# Altium project Syncbox.PrjPcb (part 3 of 3)

## Sheet [08] - CPU USB.SchDoc
size A2; Organization: Altium Limited; Address1: L3, 12a Rodborough Rd; Address2: Frenchs Forest; Address3: NSW; Address4: Australia 2086; DocumentNumber: 8; SheetNumber: 8; SheetTotal: 11
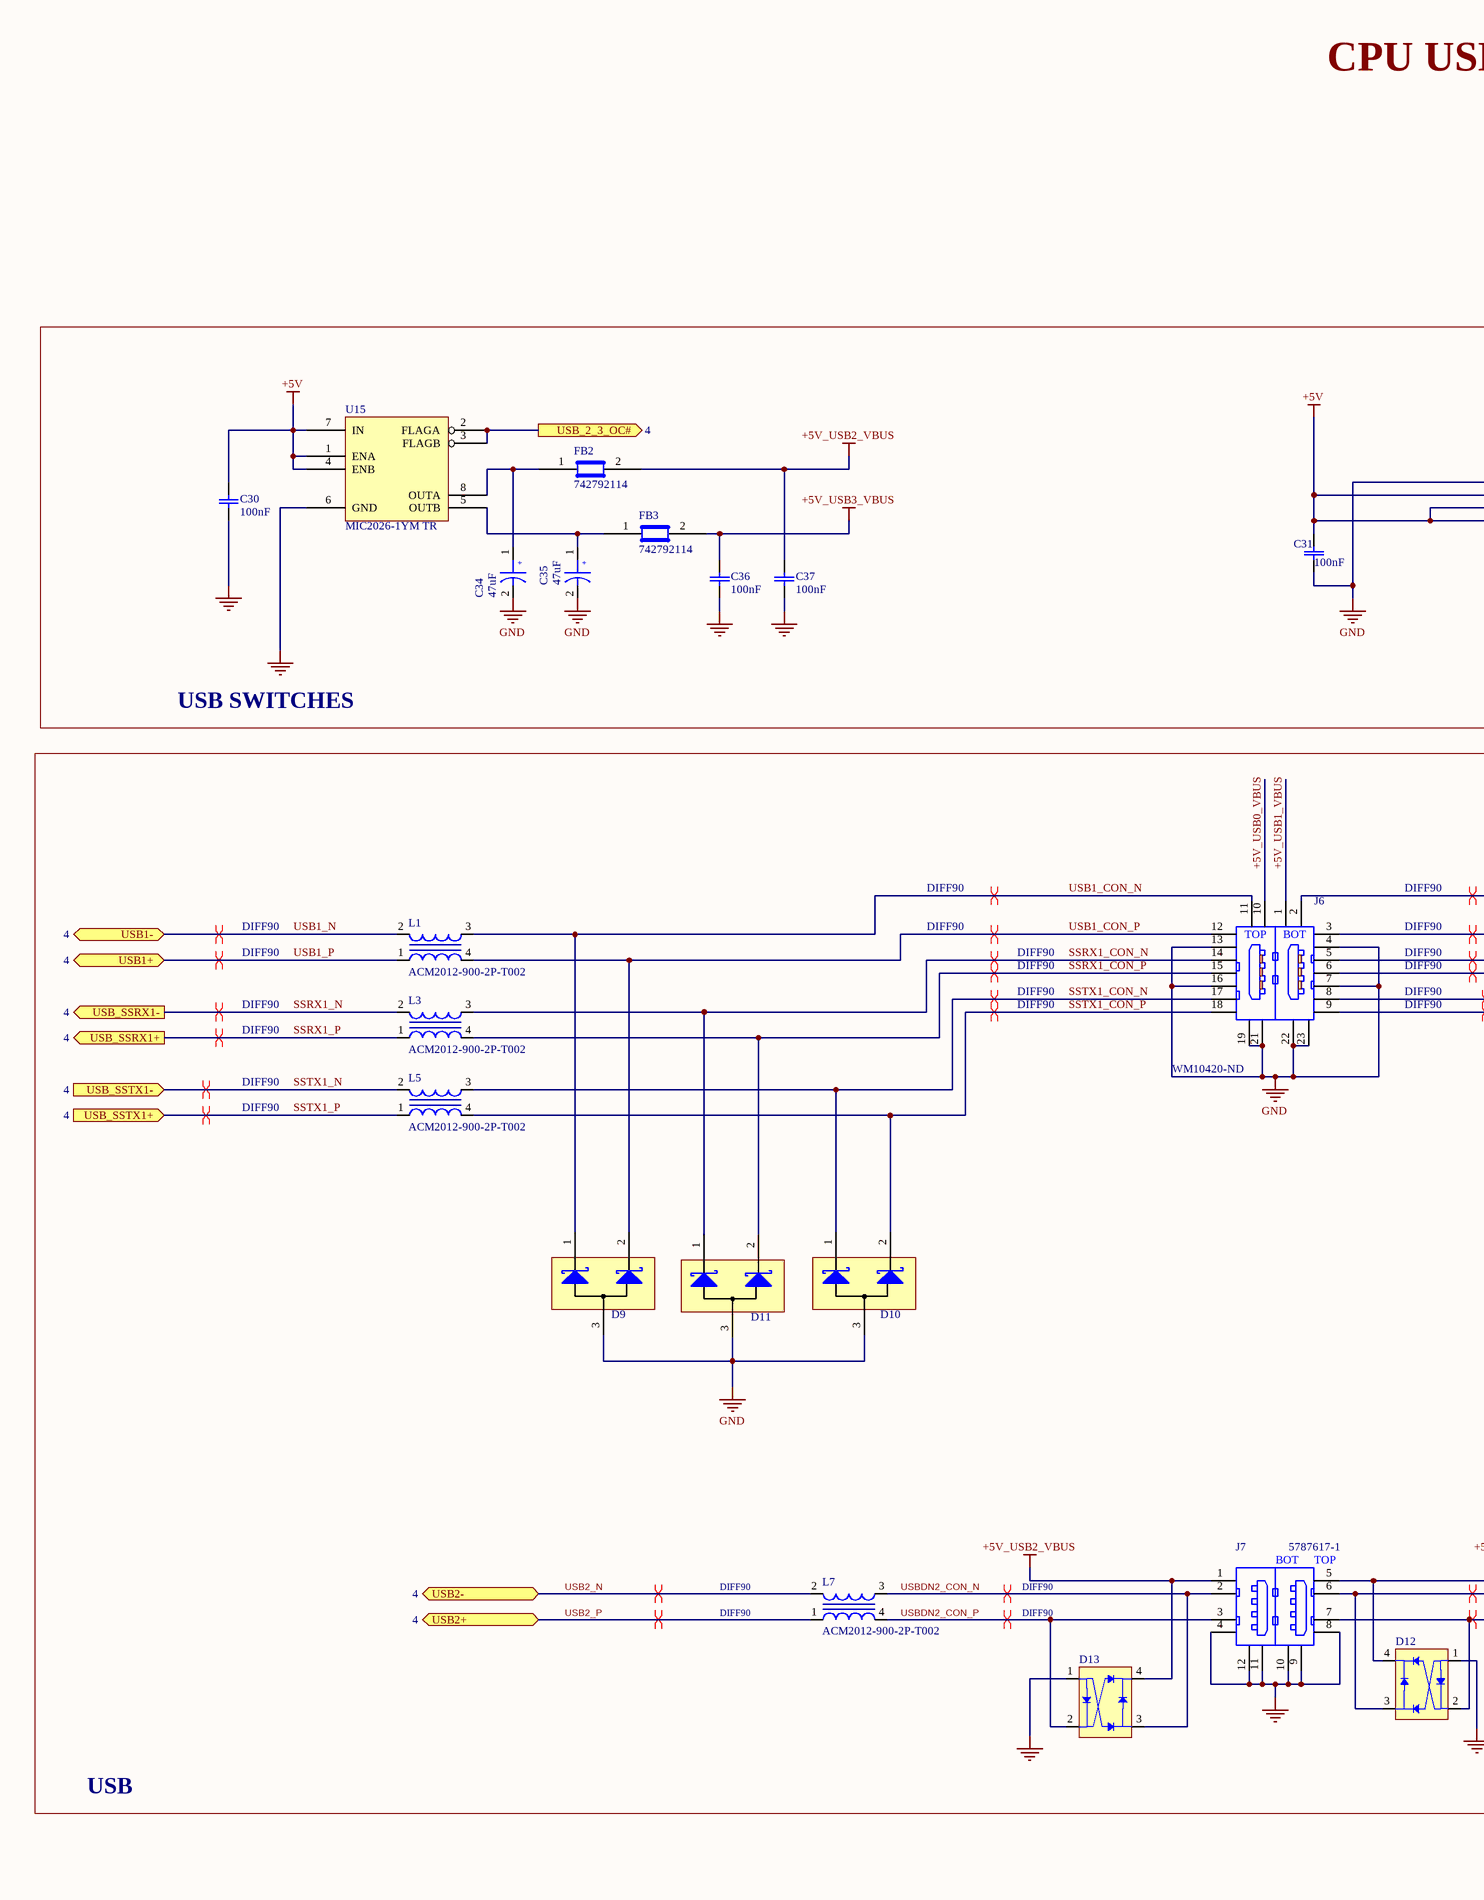
[diagram p3: [08] - CPU USB.SchDoc, left]
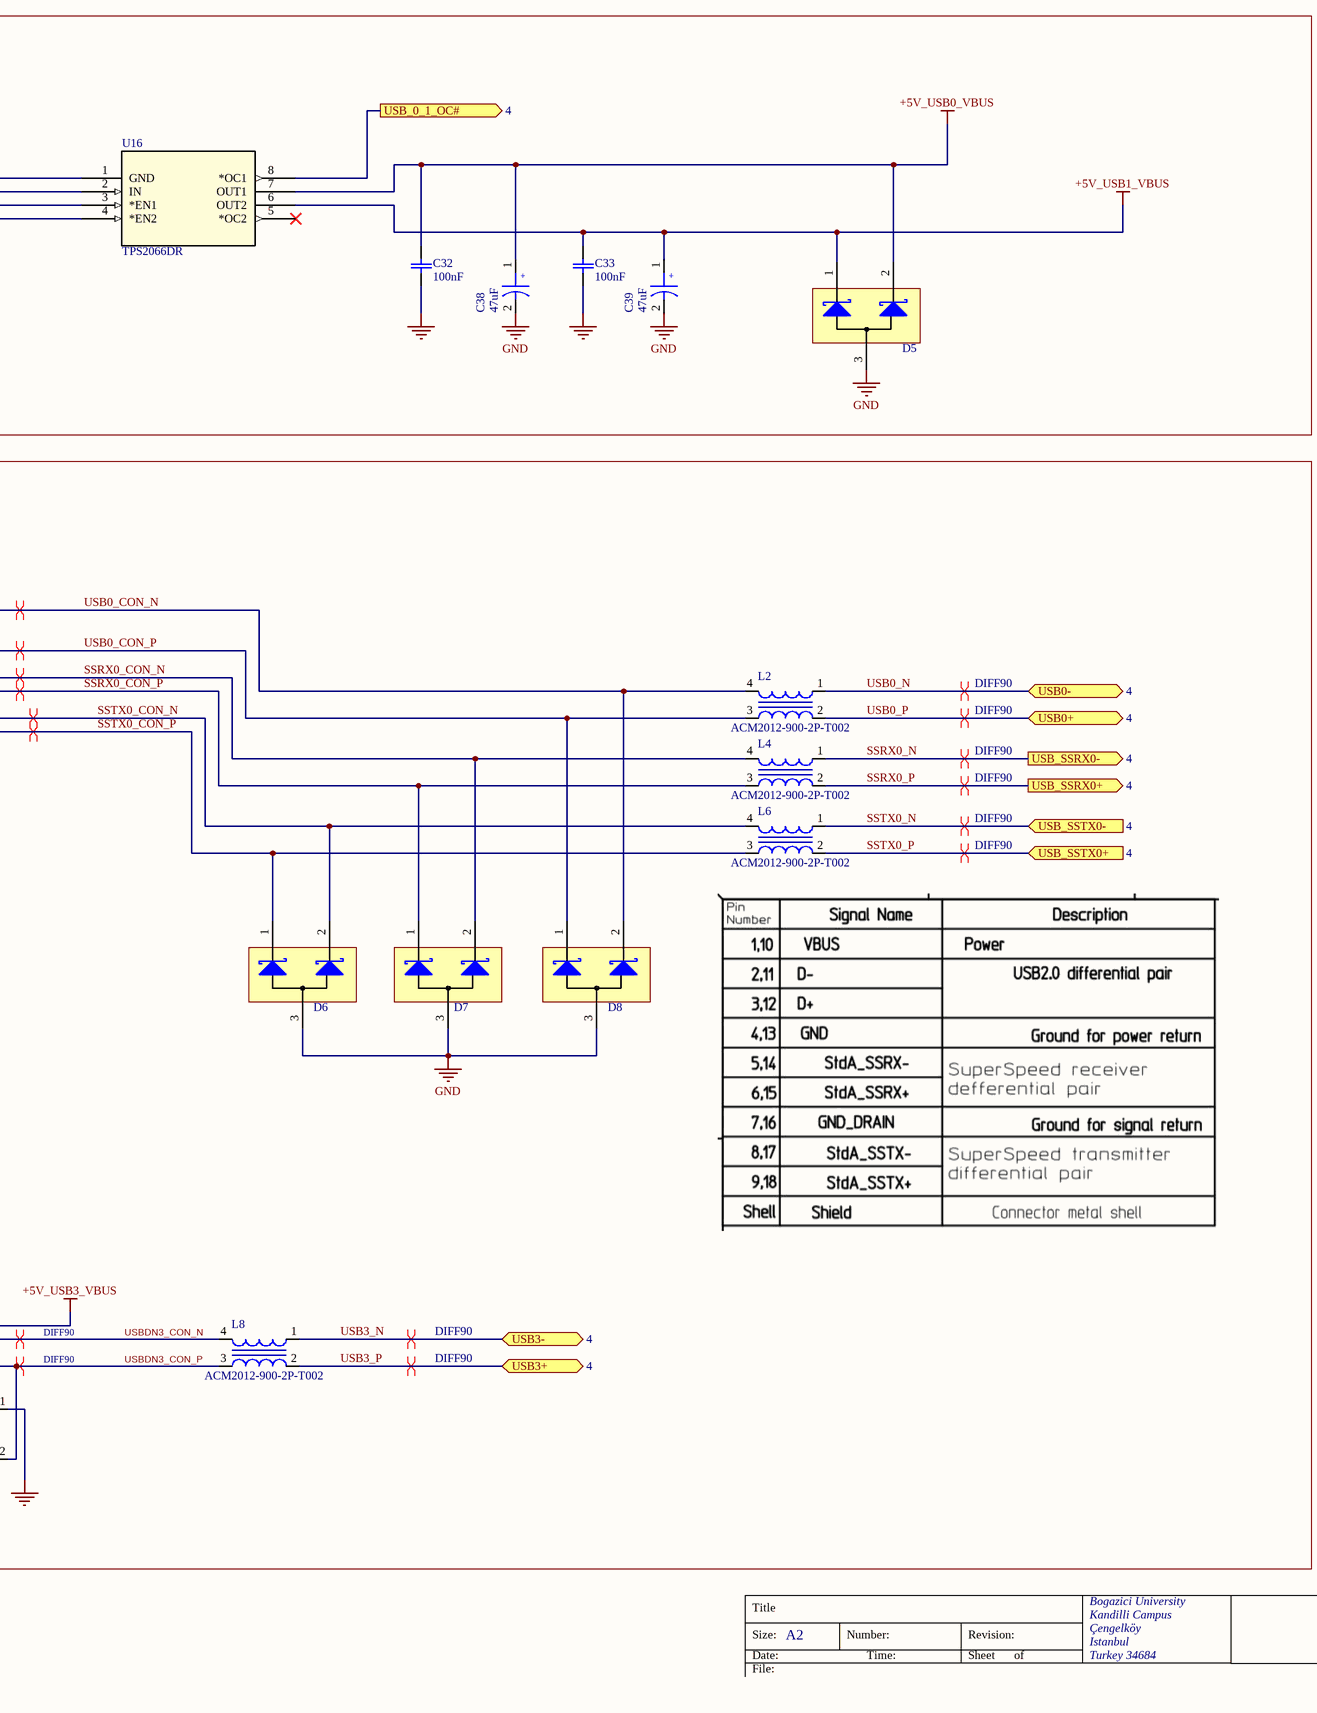
[diagram p4: [08] - CPU USB.SchDoc, right]

### Parts
C30  100nF  [C0402]
C31  100nF  [C0402]
C32  100nF  [C0402]
C33  100nF  [C0402]
C34  47uF  [CAP_P-B]
C35  47uF  [CAP_P-B]
C36  100nF  [C0402]
C37  100nF  [C0402]
C38  47uF  [CAP_P-B]
C39  47uF  [CAP_P-B]
D5  ESD5V3U2U03FH6327XTSA1  [PG-TSLP-3-7]  (value not drawn)
D6  ESD5V3U2U03FH6327XTSA1  [PG-TSLP-3-7]  (value not drawn)
D7  ESD5V3U2U03FH6327XTSA1  [PG-TSLP-3-7]  (value not drawn)
D8  ESD5V3U2U03FH6327XTSA1  [PG-TSLP-3-7]  (value not drawn)
D9  ESD5V3U2U03FH6327XTSA1  [PG-TSLP-3-7]  (value not drawn)
D10  ESD5V3U2U03FH6327XTSA1  [PG-TSLP-3-7]  (value not drawn)
D11  ESD5V3U2U03FH6327XTSA1  [PG-TSLP-3-7]  (value not drawn)
D12  BAS4002ARPPE6327HTSA1  [SOT143B]  (value not drawn)
D13  BAS4002ARPPE6327HTSA1  [SOT143B]  (value not drawn)
FB2  742792114  [Ferrite bead]
FB3  742792114  [Ferrite bead]
J6  WM10420-ND  [USB 3 STACK]
J7  5787617-1  [USB-2A]
L1  ACM2012-900-2P-T002  [ACM2012]
L2  ACM2012-900-2P-T002  [ACM2012]
L3  ACM2012-900-2P-T002  [ACM2012]
L4  ACM2012-900-2P-T002  [ACM2012]
L5  ACM2012-900-2P-T002  [ACM2012]
L6  ACM2012-900-2P-T002  [ACM2012]
L7  ACM2012-900-2P-T002  [ACM2012]
L8  ACM2012-900-2P-T002  [ACM2012]
U15  MIC2026-1YM TR  [8_SOIC_3.9MM]
U16  TPS2066DR  [D8]

### Blocks framed on the sheet
USB SWITCHES: C30-C39 D5 FB2 FB3 U15 U16
USB: D6-D13 J6 J7 L1-L8

### Ports
USB0+ (bidir, see 4), USB0- (bidir, see 4), USB1+ (bidir, see 4), USB1- (bidir, see 4), USB2+ (bidir, see 4), USB2- (bidir, see 4), USB3+ (bidir, see 4), USB3- (bidir, see 4), USB_0_1_OC# (out, see 4), USB_2_3_OC# (out, see 4), USB_SSRX0+ (out, see 4), USB_SSRX0- (out, see 4), USB_SSRX1+ (out, see 4), USB_SSRX1- (out, see 4), USB_SSTX0+ (in, see 4), USB_SSTX0- (in, see 4), USB_SSTX1+ (in, see 4), USB_SSTX1- (in, see 4)

### Nets
+5V: C30.2 C31.2 U15.1(ENA) U15.4(ENB) U15.7(IN) U16.2(IN) U16.3(*EN1) U16.4(*EN2)
+5V_USB0_VBUS: C32.2 C38.1 D5.2 J6.10(VBUS2) U16.7(OUT1)
+5V_USB1_VBUS: C33.2 C39.1 D5.1 J6.1(VBUS1) U16.6(OUT2)
+5V_USB2_VBUS: C37.2 D13.4 FB2.2 J7.1(VBUS)
+5V_USB3_VBUS: C36.2 D12.4 FB3.2 J7.5(VBUS2)
GND: C30.1 C31.1 C32.1 C33.1 C34.2 C35.2 C36.1 C37.1 C38.2 C39.2 D5.3 D6.3 D7.3 D8.3 D9.3 D10.3 D11.3 D12.1 D13.1 J6.4(GND) J6.7(GND_DRAIN1) J6.13(GND) J6.16(GND_DRAIN2) J6.19(SHIELD) J6.21(SHIELD) J6.22(SHIELD) J6.23(SHIELD) J7.4(GND) J7.8(GND) J7.9(SHIELD) J7.10(SHIELD) J7.11(SHIELD) J7.12(SHIELD) U15.6(GND) U16.1(GND)  [project net PGND]
SSRX0_CON_N: D7.2 J6.5(SSRX0-) L4.4
SSRX0_CON_P: D7.1 J6.6(SSRX0+) L4.3
SSRX0_N: L4.1 ; port USB_SSRX0-
SSRX0_P: L4.2 ; port USB_SSRX0+
SSRX1_CON_N: D11.1 J6.14(SSRX2-) L3.3
SSRX1_CON_P: D11.2 J6.15(SSRX2+) L3.4
SSRX1_N: L3.2 ; port USB_SSRX1-
SSRX1_P: L3.1 ; port USB_SSRX1+
SSTX0_CON_N: D6.2 J6.8(SSTX0-) L6.4
SSTX0_CON_P: D6.1 J6.9(SSTX0+) L6.3
SSTX0_N: L6.1 ; port USB_SSTX0-
SSTX0_P: L6.2 ; port USB_SSTX0+
SSTX1_CON_N: D10.1 J6.17(SSTX2-) L5.3
SSTX1_CON_P: D10.2 J6.18(SSTX2+) L5.4
SSTX1_N: L5.2 ; port USB_SSTX1-
SSTX1_P: L5.1 ; port USB_SSTX1+
USB0_CON_N: D8.2 J6.2(D1-) L2.4
USB0_CON_P: D8.1 J6.3(D1+) L2.3
USB0_N: L2.1 ; port USB0-
USB0_P: L2.2 ; port USB0+
USB1_CON_N: D9.1 J6.11(D2-) L1.3
USB1_CON_P: D9.2 J6.12(D2+) L1.4
USB1_N: L1.2 ; port USB1-
USB1_P: L1.1 ; port USB1+
USB2_N: L7.2 ; port USB2-
USB2_P: L7.1 ; port USB2+
USB3_N: L8.1 ; port USB3-
USB3_P: L8.2 ; port USB3+
USBDN2_CON_N: D13.3 J7.2(D-) L7.3
USBDN2_CON_P: D13.2 J7.3(D+) L7.4
USBDN3_CON_N: D12.3 J7.6(D2-) L8.4
USBDN3_CON_P: D12.2 J7.7(D2+) L8.3
NetC34_1: C34.1 FB2.1 U15.8(OUTA)
NetC35_1: C35.1 FB3.1 U15.5(OUTB)
NetU15_2: U15.2(FLAGA) U15.3(FLAGB) ; port USB_2_3_OC#
NetU16_8: U16.8(*OC1) ; port USB_0_1_OC#

Not connected (* = marked no-connect by the designer): U16 5(*OC2)*

### Layout directives
differential pair; net class DIFF90; net class USB0: USBDN2_CON_N, USBDN2_CON_P, USBDN3_CON_N, USBDN3_CON_P
differential pair; net class DIFF90: SSRX0_CON_N, SSRX0_CON_P, SSRX0_N, SSRX0_P, SSRX1_CON_N, SSRX1_CON_P, SSRX1_N, SSRX1_P, SSTX0_CON_N, SSTX0_CON_P, SSTX0_N, SSTX0_P, SSTX1_CON_N, SSTX1_CON_P, SSTX1_N, SSTX1_P, USB0_CON_N, USB0_CON_P, USB0_N, USB0_P, USB1_CON_N, USB1_CON_P, USB1_N, USB1_P, USB2_N, USB2_P, USB3_N, USB3_P

### Notes on the sheet
- CPU USB
- Title
- Bogazici University
- Size:
- Date:
- File:
- A2
- Number:
- Time:
- Revision:
- Sheet
- of
- Kandilli Campus
- Çengelköy
- Istanbul
- Turkey 34684
- (in symbol 5787617-1) BOT; TOP
- (in symbol PCG1C470MCL1GS) +
- (in symbol USB 3) TOP; BOT

### Library data of the parts
C30-C33 C36 C37 = CL05A104KA5NNNC: CAP CER 0.1UF 50V X8R 0603; Manufacturer 1: Samsung Electro-Mechanics; Voltage - Rated: 25V; Tolerance: ±10%; Temperature Coefficient: X5R; Notification: Current market demand for these product types have resulted in fluctuating and extending lead times. Lead times may differ.; Description 1: CAP CER 0.1UF 25V X5R 0402; Category: Capacitors; Operating Temperature: -55°C ~ 85°C; Package / Case: 0402 (1005 Metric); Supplier 1: Digi-Key; Supplier Part Number 1: 1276-1043-6-ND; RoHS: RoHS Compliant; Stock 1: 100000; Pricing 1: 1=0.1, 10=0.04, 100=0.0176, 500=0.0126, 1000=0.0099, 2500=0.009, 5000=0.00828 (USD); Mounting Type: Surface Mount, MLCC; Applications: General Purpose; Ratings: -; Size / Dimension: 0.039" L x 0.020" W (1.00mm x 0.50mm); Height - Seated (Max): -; Thickness (Max): 0.022" (0.55mm); Lead Spacing: -; Features: -; Packaging: Digi-Reel®; Lead Style: -; ComponentLink1URL: http://www.samsungsem.com/kr/support/product-search/mlcc/CL05A104KA5NNNC.jsp; ComponentLink1Description: http://www.samsungsem.com/kr/support/product-search/mlcc/CL05A104KA5NNNC.jsp; Manufacturer Part Number 1: CL05A104KA5NNNC; Part Status: Active
C34 C35 C38 C39 = PCG1C470MCL1GS: CAP ALUM POLY 47UF 20% 16V SMD; Manufacturer 1: Nichicon; Type: Polymer; ESR (Equivalent Series Resistance): 40 mOhm; Lifetime @ Temp.: 2000 Hrs @ 105°C; Surface Mount Land Size: 0.209" L x 0.209" W (5.30mm x 5.30mm); Manufacturer Part Number 1: PCG1C470MCL1GS; RoHS: RoHS Compliant; Stock 1: 4045; Pricing 1: 1=1.42, 10=1.123, 100=0.8422, 500=0.63636 (USD); Packaging: Digi-Reel®; Part Status: Active; Tolerance: ±20%; Operating Temperature: -55°C ~ 105°C; Ratings: -; Applications: General Purpose; Lead Spacing: -; Size / Dimension: 0.197" Dia (5.00mm); Height - Seated (Max): 0.236" (6.00mm); Mounting Type: Surface Mount; Package / Case: Radial, Can - SMD; ComponentLink1URL: http://nichicon-us.com/english/products/pdfs/e-pcg.pdf; ComponentLink1Description: http://nichicon-us.com/english/products/pdfs/e-pcg.pdf; Supplier 1: Digi-Key; Supplier Part Number 1: 493-3095-6-ND; Description 1: CAP ALUM POLY 47UF 20% 16V SMD; Category: Capacitors
D5 = ESD5V3U2U03FH6327XTSA1: TVS DIODE 5.3V 15V TSFP-3; Manufacturer 1: Infineon Technologies; Type: Zener; Voltage - Reverse Standoff (Typ): 5.3V (Max); Voltage - Breakdown (Min): 6V; Current - Peak Pulse (10/1000µs): 3A (8/20µs); Power Line Protection: No; Capacitance @ Frequency: 0.4pF @ 1MHz; Manufacturer Part Number 1: ESD5V3U2U03FH6327XTSA1; RoHS: RoHS Compliant; Stock 1: 21994; Pricing 1: 1=0.38, 10=0.311, 100=0.2118, 500=0.15886, 1000=0.11915 (USD); Packaging: Cut Tape (CT); Part Status: Active; Voltage - Clamping (Max) @ Ipp: 15V; Power - Peak Pulse: -; Applications: General Purpose; Operating Temperature: -40°C ~ 125°C (TJ); Mounting Type: Surface Mount; Package / Case: SOT-723; Supplier Device Package: PG-TSFP-3; Base Part Number: ESD5V3; ComponentLink1URL: https://www.infineon.com/dgdl/esd5v3u2useries.pdf?folderId=db3a30431441fb5d011488a9e66f0ded&fileId=db3a30431b0626df011b0d3e3ca97dc0; ComponentLink1Description: https://www.infineon.com/dgdl/esd5v3u2useries.pdf?folderId=db3a30431441fb5d011488a9e66f0ded&fileId=db3a30431b0626df011b0d3e3ca97dc0; Supplier 1: Digi-Key; Supplier Part Number 1: ESD5V3U2U03FH6327XTSA1CT-ND; Description 1: TVS DIODE 5.3V 15V TSFP-3; Category: Circuit Protection
D6-D11 = ESD5V3U2U03FH6327XTSA1: TVS DIODE 5.3V 15V TSFP-3; Manufacturer 1: Infineon Technologies; Type: Zener; Voltage - Reverse Standoff (Typ): 5.3V (Max); Voltage - Breakdown (Min): 6V; Current - Peak Pulse (10/1000µs): 3A (8/20µs); Power Line Protection: No; Capacitance @ Frequency: 0.4pF @ 1MHz; .Checked PCB: USED; Manufacturer Part Number 1: ESD5V3U2U03FH6327XTSA1; RoHS: RoHS Compliant; Stock 1: 21994; Pricing 1: 1=0.38, 10=0.311, 100=0.2118, 500=0.15886, 1000=0.11915 (USD); Packaging: Cut Tape (CT); Part Status: Active; Voltage - Clamping (Max) @ Ipp: 15V; Power - Peak Pulse: -; Applications: General Purpose; Operating Temperature: -40°C ~ 125°C (TJ); Mounting Type: Surface Mount; Package / Case: SOT-723; Supplier Device Package: PG-TSFP-3; Base Part Number: ESD5V3; ComponentLink1URL: https://www.infineon.com/dgdl/esd5v3u2useries.pdf?folderId=db3a30431441fb5d011488a9e66f0ded&fileId=db3a30431b0626df011b0d3e3ca97dc0; ComponentLink1Description: https://www.infineon.com/dgdl/esd5v3u2useries.pdf?folderId=db3a30431441fb5d011488a9e66f0ded&fileId=db3a30431b0626df011b0d3e3ca97dc0; Supplier 1: Digi-Key; Supplier Part Number 1: ESD5V3U2U03FH6327XTSA1CT-ND; Description 1: TVS DIODE 5.3V 15V TSFP-3; Category: Circuit Protection; .Checked SCH: USED
D12 D13 = BAS4002ARPPE6327HTSA1: DIODE BRIDGE 40V 200MA SOT 143; Manufacturer 1: Infineon Technologies; Diode Type: Single Phase; .Checked PCB: USED; Manufacturer Part Number 1: BAS4002ARPPE6327HTSA1; RoHS: RoHS Compliant; Stock 1: 44305; Pricing 1: 1=0.47, 10=0.406, 100=0.3031, 500=0.23816, 1000=0.18403 (USD); Packaging: Digi-Reel®; Part Status: Active; Technology: Standard; Operating Temperature: 150°C (TJ); Mounting Type: Surface Mount; Package / Case: TO-253-4, TO-253AA; Supplier Device Package: PG-SOT143-4; Base Part Number: BAS4002; ComponentLink1URL: https://www.infineon.com/dgdl/bas4002aseries.pdf?folderId=db3a30431f848401011fcbf2ab4c04c4&fileId=db3a304329a0f6ee0129a6dc9f802b68; ComponentLink1Description: https://www.infineon.com/dgdl/bas4002aseries.pdf?folderId=db3a30431f848401011fcbf2ab4c04c4&fileId=db3a304329a0f6ee0129a6dc9f802b68; Supplier 1: Digi-Key; Supplier Part Number 1: BAS4002ARPPE6327HTSA1DKR-ND; Description 1: DIODE BRIDGE 40V 200MA SOT 143; Category: Discrete Semiconductor Products; .Checked SCH: USED
FB2 FB3 = FB742792114: FERRITE BEAD 50 OHM 1206 1LN; Filter Type: Signal Line; Current Rating (Max): 3A; DC Resistance (DCR) (Max): 25 mOhm; Supplier 1: Digi-Key; Supplier Part Number 1: 732-1621-6-ND; Manufacturer 2: Wurth Electronics Inc.; Manufacturer Part Number 2: 742792114; RoHS: RoHS Compliant; Stock 2: 21934; Pricing 2: 1=0.24, 10=0.238, 50=0.219, 100=0.209, 500=0.2, 1000=0.19 (USD); Packaging: Cut Tape (CT); Part Status: Active; Ratings: -; Operating Temperature: -55°C ~ 125°C; Package / Case: 1206 (3216 Metric); Mounting Type: Surface Mount; Height (Max): 0.051" (1.30mm); Size / Dimension: 0.126" L x 0.063" W (3.20mm x 1.60mm); ComponentLink1URL: http://katalog.we-online.de/pbs/datasheet/742792114.pdf; ComponentLink1Description: http://katalog.we-online.de/pbs/datasheet/742792114.pdf; Supplier 2: Digi-Key; Supplier Part Number 2: 732-1621-1-ND; Description 2: FERRITE BEAD 50 OHM 1206 1LN; Category: Filters
J6 = USB 3: USB 3.0 RA DUAL REC TH TYPE A; Manufacturer 1: Molex, LLC; Manufacturer Part Number 1: 0484060003; Connector Type: USB - A, Stacked; Number of Contacts: 18; Gender: Receptacle; Specifications: USB 3.0 (USB 3.1 Gen 1, Superspeed); Current Rating: 0.25A, 1.8A; Voltage - Rated: 30VAC/DC; Mating Cycles: 5000; Shielding: Shielded; Material Flammability Rating: UL94 HB; .Checked PCB: USED; RoHS: RoHS Compliant; Stock 1: 11990; Pricing 1: 1=2.23, 10=2.026, 25=1.902, 50=1.8194, 100=1.7367, 250=1.57132, 500=1.44726, 1000=1.2405, 2500=1.1578 (USD); Packaging: Tray; Part Status: Active; Mounting Type: Through Hole, Right Angle; Mounting Feature: Horizontal; Termination: Solder; Features: Board Lock; Ingress Protection: -; Operating Temperature: -20°C ~ 85°C; Contact Finish: Gold; Shell/Shielding Material: Steel, Stainless; Insulation Color: Blue; ComponentLink1URL: https://www.molex.com/pdm_docs/sd/484060003_sd.pdf; ComponentLink1Description: https://www.molex.com/pdm_docs/sd/484060003_sd.pdf; Description 1: USB 3.0 RA DUAL REC TH TYPE A; Category: Connectors, Interconnects; Supplier 1: Digi-Key; Supplier Part Number 1: WM10420-ND; .Checked SCH: USED
J7 = 5787617-1: CONN RCPT R/A 4OVER4POS GOLD PCB; Manufacturer: TE Connectivity; .Checked PCB: USED; Connector Type: USB - A, Stacked; Number of Contacts: 8; Gender: Receptacle; Specifications: USB 2.0; .Checked SCH: USED; Category: Connectors, Interconnects; Family: USB, IEEE-1394 (Firewire), DVI, HDMI; Manufacturer Part Number: 5787617-1; Price 1k [$]: 1.68753; Supplier: Digikey; Supplier Part Number: A31728-ND; Value: 5787617-1; Supplier 1: Digi-Key; Supplier Part Number 1: A31728-ND; RoHS: RoHS Compliant; Stock 1: 5401; Pricing 1: 1=3.33, 10=3.197, 25=2.9308, 50=2.7978, 100=2.6645, 250=2.33144, 500=2.26484, 1000=1.93178, 2500=1.79855 (USD); Mounting Type: Through Hole, Right Angle, Horizontal; Features: Board Lock; Packaging: Tray; Ingress Protection: -; ComponentLink1URL: http://documents.tycoelectronics.com/commerce/DocumentDelivery/DDEController?Action=srchrtrv&DocNm=5787617&DocType=CD&DocLang=EN; ComponentLink1Description: http://documents.tycoelectronics.com/commerce/DocumentDelivery/DDEController?Action=srchrtrv&DocNm=5787617&DocType=CD&DocLang=EN
L1-L8 = ACM2012-900-2P-T002: CHOKE COMM MODE 90 OHM .4A SMD; Manufacturer: TDK Corporation; Filter Type: Data, Signal Line; Number of Lines: 2; Current: 400mA; DC Resistance (DCR): 190 mOhm Max; Impedance: 90 Ohm; Resistance (Ohms): 8.2K; Power (Watts): 0.063W, 1/16W; Temperature Coefficient: ±100ppm/°C; Tolerance: ±1%; .Checked PCB: USED; Supplier 1: Digi-Key; Supplier Part Number 1: 445-2207-1-ND; Manufacturer Part Number: ACM2012-900-2P-T002; RoHS: RoHS Compliant; Category: Filters; Stock 1: 175768; Pricing 1: 1=0.48, 10=0.448, 50=0.42, 100=0.364, 500=0.308, 1000=0.252 (USD); Inductance: -; Mounting Type: Surface Mount; Size / Dimension: 0.079" L x 0.047" W (2.00mm x 1.20mm); Height (Max): 0.051" (1.30mm); Package / Case: 0805 (2012 Metric), 4 Lead; Operating Temperature: -25°C ~ 85°C; Packaging: Cut Tape (CT); ComponentLink1URL: http://www.tdk.co.jp/tefe02/e9719_acm2012.pdf; ComponentLink1Description: http://www.tdk.co.jp/tefe02/e9719_acm2012.pdf; Composition: Thick Film; Features: -; Height: 0.016" (0.40mm); Number of Terminations: 2; ComponentLink2URL: http://www.yageo.com/documents/recent/PYu-RC0402_51_RoHS_L_6.pdf; ComponentLink2Description: http://www.yageo.com/documents/recent/PYu-RC0402_51_RoHS_L_6.pdf; .Checked SCH: USED
U15 = MIC2026-1YM TR: IC SW DISTRIBUTION 2CHAN 8SOIC; Manufacturer: Micrel Inc; Number of Outputs: 2; Rds (On): 140 mOhm; Internal Switch(s): Yes; Current Limit: 900mA; Voltage - Input: 2.7 V ~ 5.5 V; Category: Integrated Circuits (ICs); Family: PMIC - Power Distribution Switches; Manufacturer Part Number: MIC2026-1YM TR; Operating Temperature: -40°C ~ 85°C; Package / Case: 8-SOIC (0.154", 3.90mm Width); Price 1k [$]: 0.53200; Supplier: Digikey; Supplier Part Number: 576-1059-1-ND; Value: MIC2026-1YM TR; Supplier 1: Digi-Key; Supplier Part Number 1: 576-1059-1-ND; RoHS: RoHS Compliant; Stock 1: 44857; Pricing 1: 1=1.14, 25=0.95, 100=0.76, 250=0.57, 500=0.532 (USD); Type: High Side Switch; Mounting Type: Surface Mount; Supplier Device Package: 8-SOIC; Packaging: Cut Tape (CT); ComponentLink1URL: http://www.micrel.com/_PDF/mic2026.pdf; ComponentLink1Description: http://www.micrel.com/_PDF/mic2026.pdf
U16 = TPS2066DR: IC PWR DIST SW DUAL 8SOIC; Vendor: Texas Instruments; Built_By: EMA_UL_Team; C: Copyright (C) 2015 Accelerated Designs. All rights reserved; Switch Type: General Purpose; Number of Outputs: 2; Ratio - Input:Output: 1:2; Output Configuration: High Side; Output Type: N-Channel; Interface: On/Off; Voltage - Load: 2.7 V ~ 5.5 V; Voltage - Supply (Vcc/Vdd): Not Required; Current - Output (Max): 1A; Rds On (Typ): 70 mOhm; Input Type: Non-Inverting; Fault Protection: Current Limiting (Fixed), Over Temperature, UVLO; Manufacturer_Part_Number: TPS2066DR; Manufacturer: Texas Instruments; RefDes: RefDes; Type: DEV; Value: Value; Manufacturer 1: Texas Instruments; Manufacturer Part Number 1: TPS2066DR; RoHS: RoHS Compliant; Stock 1: 12576; Pricing 1: 1=1.87, 10=1.681, 100=1.3514, 500=1.11034, 1000=0.92 (USD); Packaging: Digi-Reel®; Part Status: Active; Features: Status Flag; Operating Temperature: -40°C ~ 125°C (TJ); Package / Case: 8-SOIC (0.154", 3.90mm Width); Supplier Device Package: 8-SOIC; Base Part Number: TPS2066; ComponentLink1URL: http://www.ti.com/lit/ds/symlink/tps2061.pdf; ComponentLink1Description: http://www.ti.com/lit/ds/symlink/tps2061.pdf; Supplier 1: Digi-Key; Supplier Part Number 1: 296-28004-6-ND; Description 1: IC PWR DIST SW DUAL 8SOIC; Category: Integrated Circuits (ICs)

## Sheet [09] - PCB AND MECHANICALS.SchDoc
size A2; Organization: Altium Limited; Address1: L3, 12a Rodborough Rd; Address2: Frenchs Forest; Address3: NSW; Address4: Australia 2086; DocumentNumber: 9; SheetNumber: 9; SheetTotal: 11
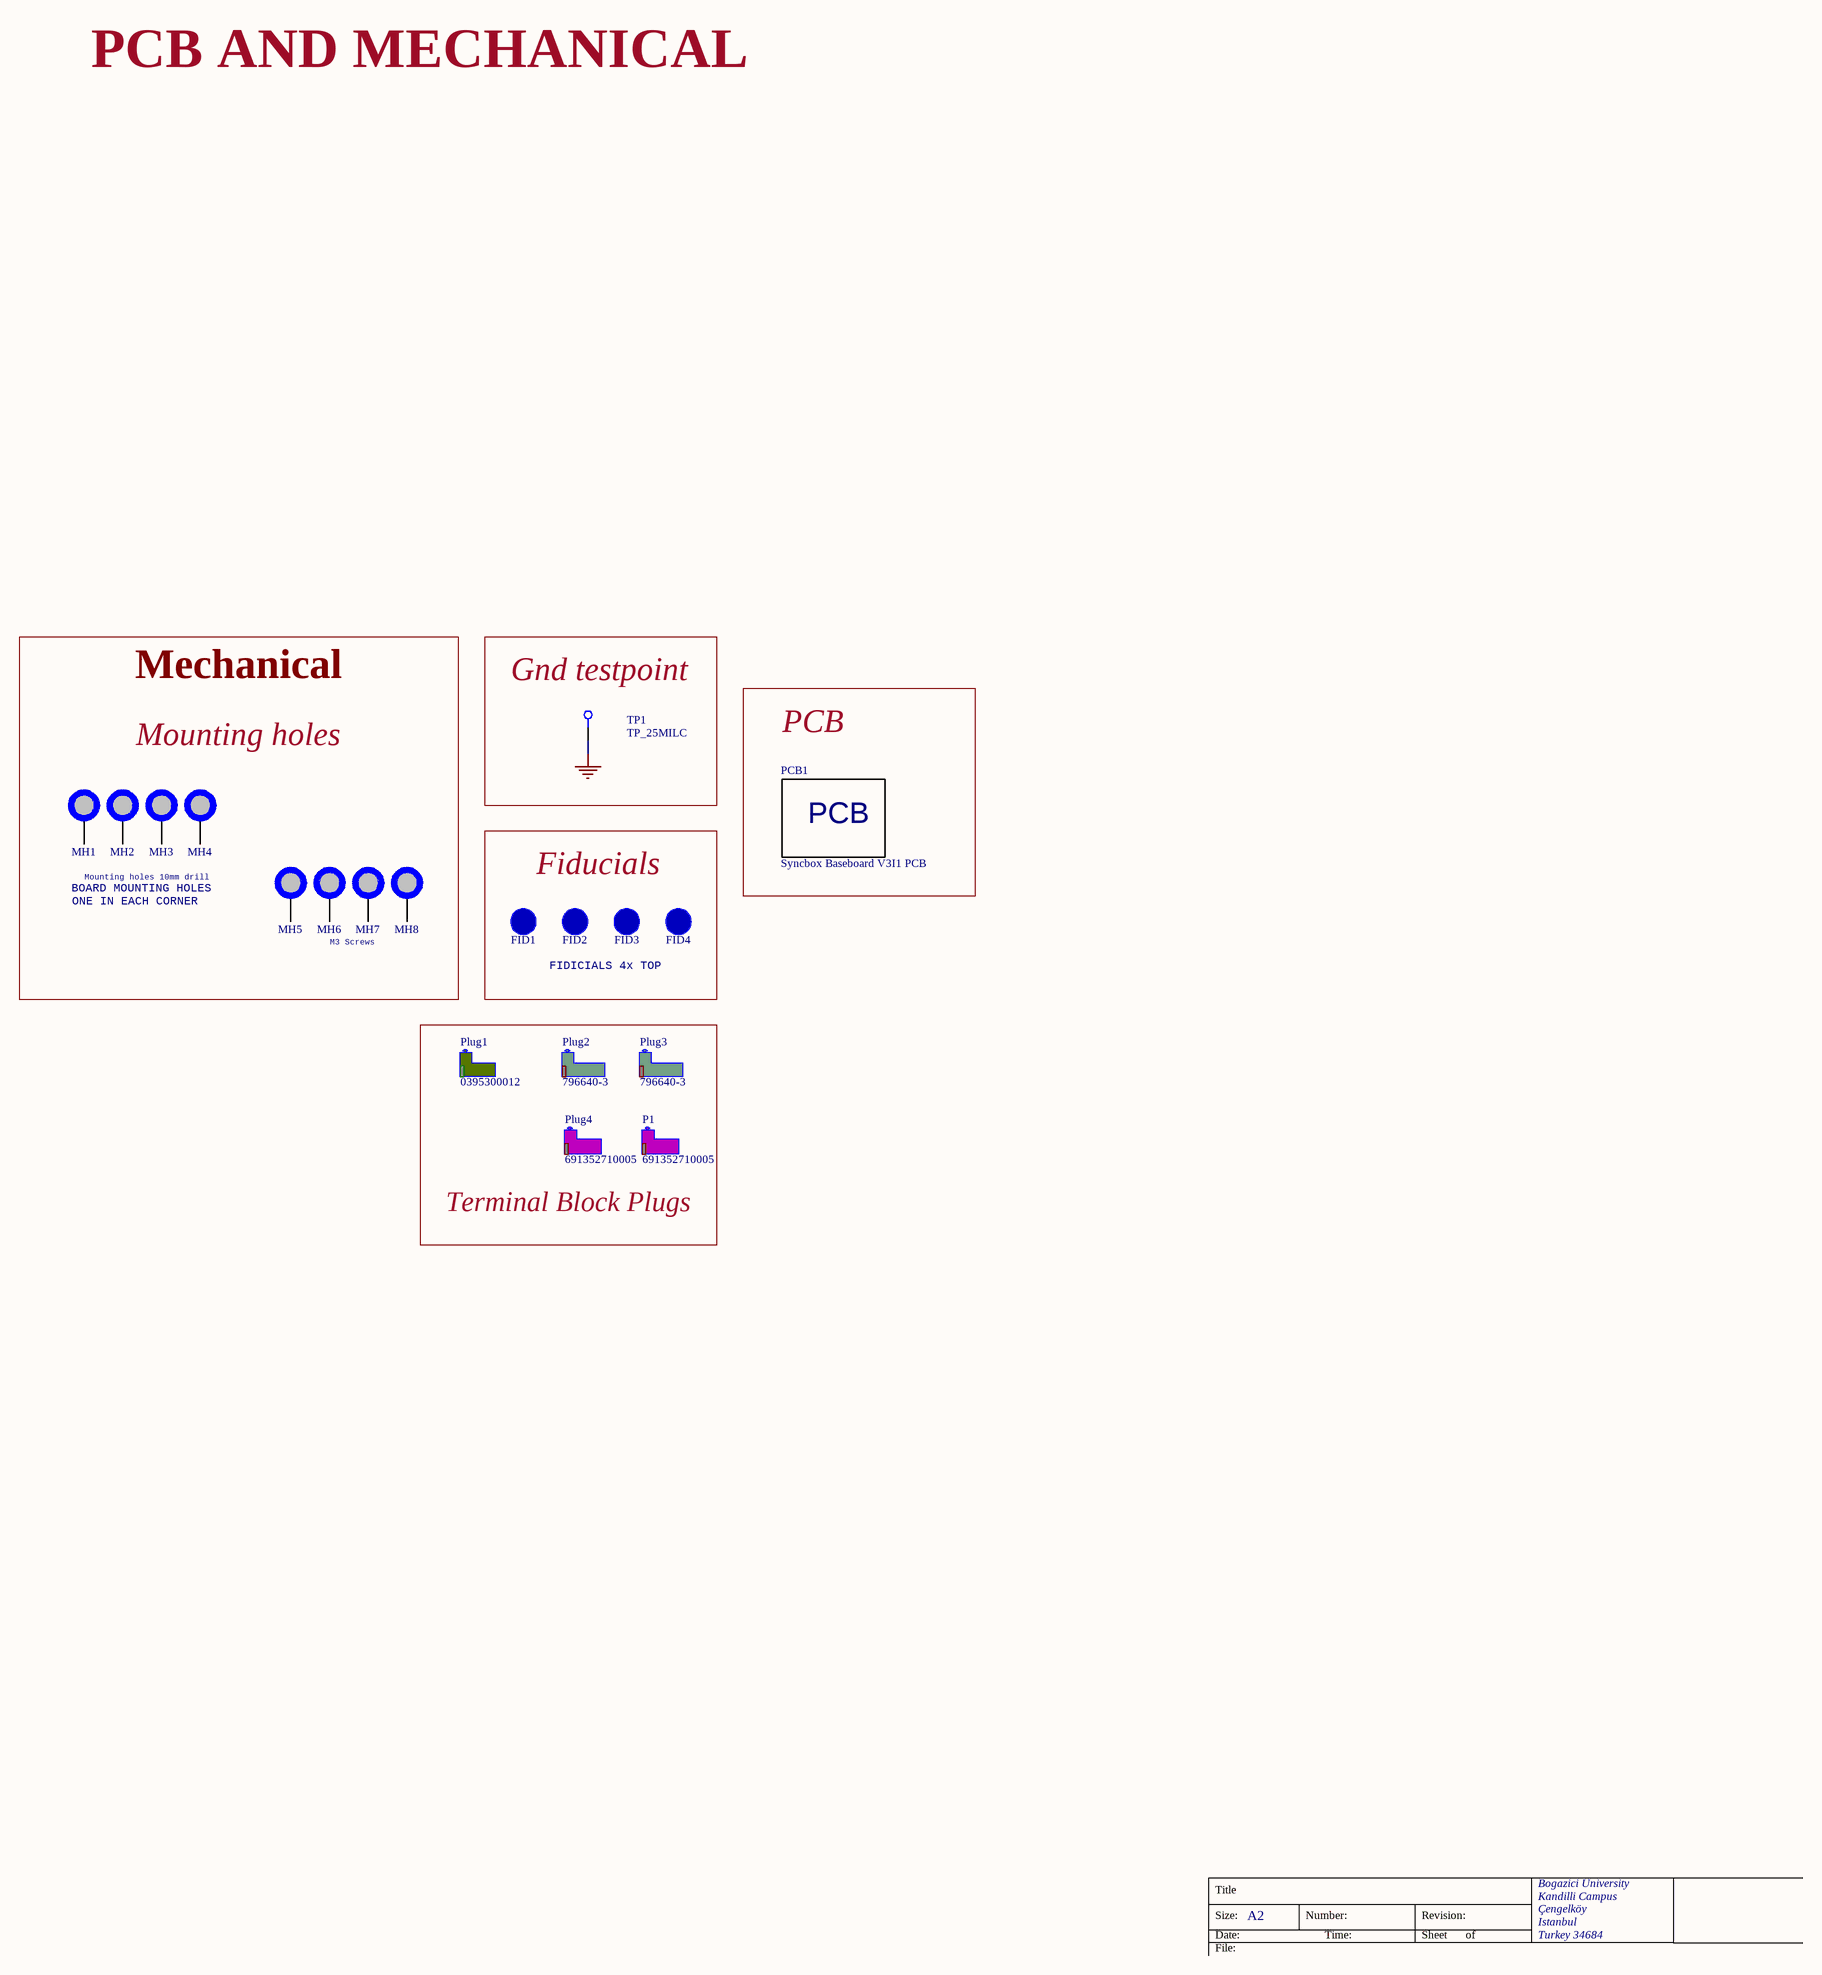
[diagram p5: [09] - PCB AND MECHANICALS.SchDoc]

### Parts
FID1  FID_1MMC  [FID_40X120D]  (value not drawn)  (no BOM)
FID2  FID_1MMC  [FID_40X120D]  (value not drawn)  (no BOM)
FID3  FID_1MMC  [FID_40X120D]  (value not drawn)  (no BOM)
FID4  FID_1MMC  [FID_40X120D]  (value not drawn)  (no BOM)
MH1  MH_12MMC_10MMD  [MH_12MMC_10MMD]  (value not drawn)  (no BOM)
MH2  MH_12MMC_10MMD  [MH_12MMC_10MMD]  (value not drawn)  (no BOM)
MH3  MH_12MMC_10MMD  [MH_12MMC_10MMD]  (value not drawn)  (no BOM)
MH4  MH_12MMC_10MMD  [MH_12MMC_10MMD]  (value not drawn)  (no BOM)
MH5  MH_7MMC_3.2MMD  [MH_7MMC_3.2MMD]  (value not drawn)  (no BOM)
MH6  MH_7MMC_3.2MMD  [MH_7MMC_3.2MMD]  (value not drawn)  (no BOM)
MH7  MH_7MMC_3.2MMD  [MH_7MMC_3.2MMD]  (value not drawn)  (no BOM)
MH8  MH_7MMC_3.2MMD  [MH_7MMC_3.2MMD]  (value not drawn)  (no BOM)
P1  691352710005  (mechanical)
PCB1  Syncbox Baseboard V3I1 PCB  (mechanical)
Plug1  0395300012  (mechanical)
Plug2  796640-3  (mechanical)
Plug3  796640-3  (mechanical)
Plug4  691352710005  (mechanical)
TP1  TP_25MILC  [TP_25C]  (no BOM)

### Blocks framed on the sheet
Mechanical: MH1-MH8
Gnd testpoint: TP1
PCB: PCB1
Fiducials: FID1-FID4
Terminal Block Plugs: P1 Plug1-Plug4

### Nets
GND: TP1.1  [project net PGND]

Not connected (* = marked no-connect by the designer): MH1 1; MH2 1; MH3 1; MH4 1; MH5 1; MH6 1; MH7 1; MH8 1

### Notes on the sheet
- PCB AND MECHANICAL
- Mounting holes
- BOARD MOUNTING HOLES
- Mounting holes 10mm drill
- ONE IN EACH CORNER
- M3 Screws
- FIDICIALS 4x TOP
- Title
- Bogazici University
- Size:
- Date:
- File:
- A2
- Number:
- Time:
- Revision:
- Sheet
- of
- Kandilli Campus
- Çengelköy
- Istanbul
- Turkey 34684
- (in symbol PCB_iMX6_REX_Baseboard_V1I1) PCB

### Library data of the parts
FID1-FID4 = FID_1MMC: Fiducial 40mil Diameter, 120mil Mask; Supplier: Digikey
MH1-MH4 = MH_12MMC_10MMD: Mounting Hole 12mm Diameter, 10mm Drill
MH5-MH8 = MH_7MMC_3.2MMD: Mounting Hole 7mm Diameter, 3.2mm Drill
P1 Plug4 = 691352710005: TERM BLOCK PLUG 5POS STR 5MM; Manufacturer 1: Wurth Electronics Inc.; Number of Positions: 5; Number of Levels: 1; Pitch: 0.197" (5.00mm); Plug Wire Entry: 180°; Wire Gauge or Range - AWG: 12-24 AWG; Wire Gauge or Range - mm²: 0.2-3mm²; Material Flammability Rating: UL94 V-0; Screw Size: M3; Torque - Screw: 0.56 Nm (5.0 Lb-In); Wire Strip Length: 7-8mm; Manufacturer Part Number 1: 691352710005; RoHS: RoHS Compliant; Stock 1: 164; Pricing 1: 1=3.02, 10=2.706, 50=2.337, 150=2.091, 300=1.968 (USD); Packaging: Bulk; Part Status: Active; Type: Plug, Female Sockets; Positions Per Level: 5; Header Orientation: -; Termination Style: Screw - Leaf Spring, Wire Guard; Mounting Type: Free Hanging (In-Line); Current - IEC: -; Color: Green; Operating Temperature: -40°C ~ 105°C; Contact Mating Finish: -; Features: Retention Latches (Non-Wire Side); Ingress Protection: -; Contact Material: -; Housing Material: Polyamide (PA66), Nylon 6/6; Contact Tail Length: -; Insulation Height: 0.594" (15.09mm); ComponentLink1URL: http://katalog.we-online.de/em/datasheet/6913527100xx.pdf; ComponentLink1Description: http://katalog.we-online.de/em/datasheet/6913527100xx.pdf; Supplier 1: Digi-Key; Supplier Part Number 1: 732-2778-ND; Description 1: TERM BLOCK PLUG 5POS STR 5MM; Category: Connectors, Interconnects
PCB1 = PCB_iMX6_REX_Baseboard_V1I1: Printed Circuit Board; .Creator: MM; Category: Printed circuits board
Plug1 = 0395300012: TERM BLOCK PLUG 12POS STR 5.08MM; Manufacturer 1: Molex, LLC; Number of Positions: 12; Number of Levels: 1; Pitch: 0.200" (5.08mm); Plug Wire Entry: 180°; Wire Gauge or Range - AWG: 12-26 AWG; Screw Size: M3; Torque - Screw: 0.56 Nm (5.0 Lb-In); Wire Strip Length: 5mm; Manufacturer Part Number 1: 0395300012; RoHS: RoHS Compliant; Stock 1: 734; Pricing 1: 1=6.65, 10=5.245, 25=4.9892, 50=4.5286, 100=4.3494, 250=3.83772, 500=3.58188, 1000=3.32602 (USD); Packaging: Bulk; Part Status: Active; Type: Plug, Female Sockets; Positions Per Level: 12; Header Orientation: -; Termination Style: Screw - Rising Cage Clamp; Mounting Type: Free Hanging (In-Line); Current - IEC: -; Wire Gauge or Range - mm²: -; Color: Black; Operating Temperature: -40°C ~ 115°C; Contact Mating Finish: Tin; Features: Retention Latches (Non-Wire Side); Material Flammability Rating: -; Ingress Protection: -; Contact Material: Copper Alloy; Housing Material: Polyamide (PA), Nylon; Contact Tail Length: -; Insulation Height: 0.591" (15.00mm); ComponentLink1URL: https://www.molex.com/pdm_docs/sd/395300002_sd.pdf; ComponentLink1Description: https://www.molex.com/pdm_docs/sd/395300002_sd.pdf; Supplier 1: Digi-Key; Supplier Part Number 1: WM7825-ND; Description 1: TERM BLOCK PLUG 12POS STR 5.08MM; Category: Connectors, Interconnects
Plug2 Plug3 = 796640-3: TERM BLOCK PLUG 3POS STR 5MM; Manufacturer 1: TE Connectivity AMP Connectors; Number of Positions: 3; Number of Levels: 1; Pitch: 0.197" (5.00mm); Plug Wire Entry: 180°; Wire Gauge or Range - AWG: 12-30 AWG; Wire Gauge or Range - mm²: 0.05-3mm²; Material Flammability Rating: UL94 V-0; Screw Size: M3; Torque - Screw: 0.79 Nm (7.0 Lb-In); Wire Strip Length: 6-7.5mm; Manufacturer Part Number 1: 796640-3; RoHS: RoHS Compliant; Stock 1: 7038; Pricing 1: 1=2.83, 10=2.144, 25=1.9872, 50=1.7866, 100=1.7431, 250=1.5252, 500=1.39446, 1000=1.26373, 5000=1.11121 (USD); Packaging: Bulk; Part Status: Active; Type: Plug, Female Sockets; Positions Per Level: 3; Header Orientation: -; Termination Style: Screw - Rising Cage Clamp; Mounting Type: Free Hanging (In-Line); Current - IEC: -; Color: Green; Operating Temperature: -40°C ~ 110°C; Contact Mating Finish: Tin; Features: Retention Latches (Non-Wire Side), Side Stacking; Ingress Protection: -; Contact Material: Phosphor Bronze; Housing Material: Polyamide (PA66), Nylon 6/6; Contact Tail Length: -; Insulation Height: 0.610" (15.49mm); ComponentLink1URL: http://www.te.com/commerce/DocumentDelivery/DDEController?Action=srchrtrv&DocNm=796640&DocType=Customer+Drawing&DocLang=English; ComponentLink1Description: http://www.te.com/commerce/DocumentDelivery/DDEController?Action=srchrtrv&DocNm=796640&DocType=Customer+Drawing&DocLang=English; Supplier 1: Digi-Key; Supplier Part Number 1: A98242-ND; Description 1: TERM BLOCK PLUG 3POS STR 5MM; Category: Connectors, Interconnects
TP1 = TP_25MILC: Test Point 25mil

## Nets that join several sheets
+5V: [05] - POWER (10 pins), [08] - CPU USB (8 pins)
PGND: [03] - MICRO CONTROLLER (19 pins), [05] - POWER (50 pins), [08] - CPU USB (35 pins), [09] - PCB AND MECHANICALS (TP1.1)
PWR_OUT2: [03] - MICRO CONTROLLER (13 pins), [05] - POWER (12 pins)